# EAGLE schematic power (EAGLE 9.3.0)

## Sheet 1 of 2
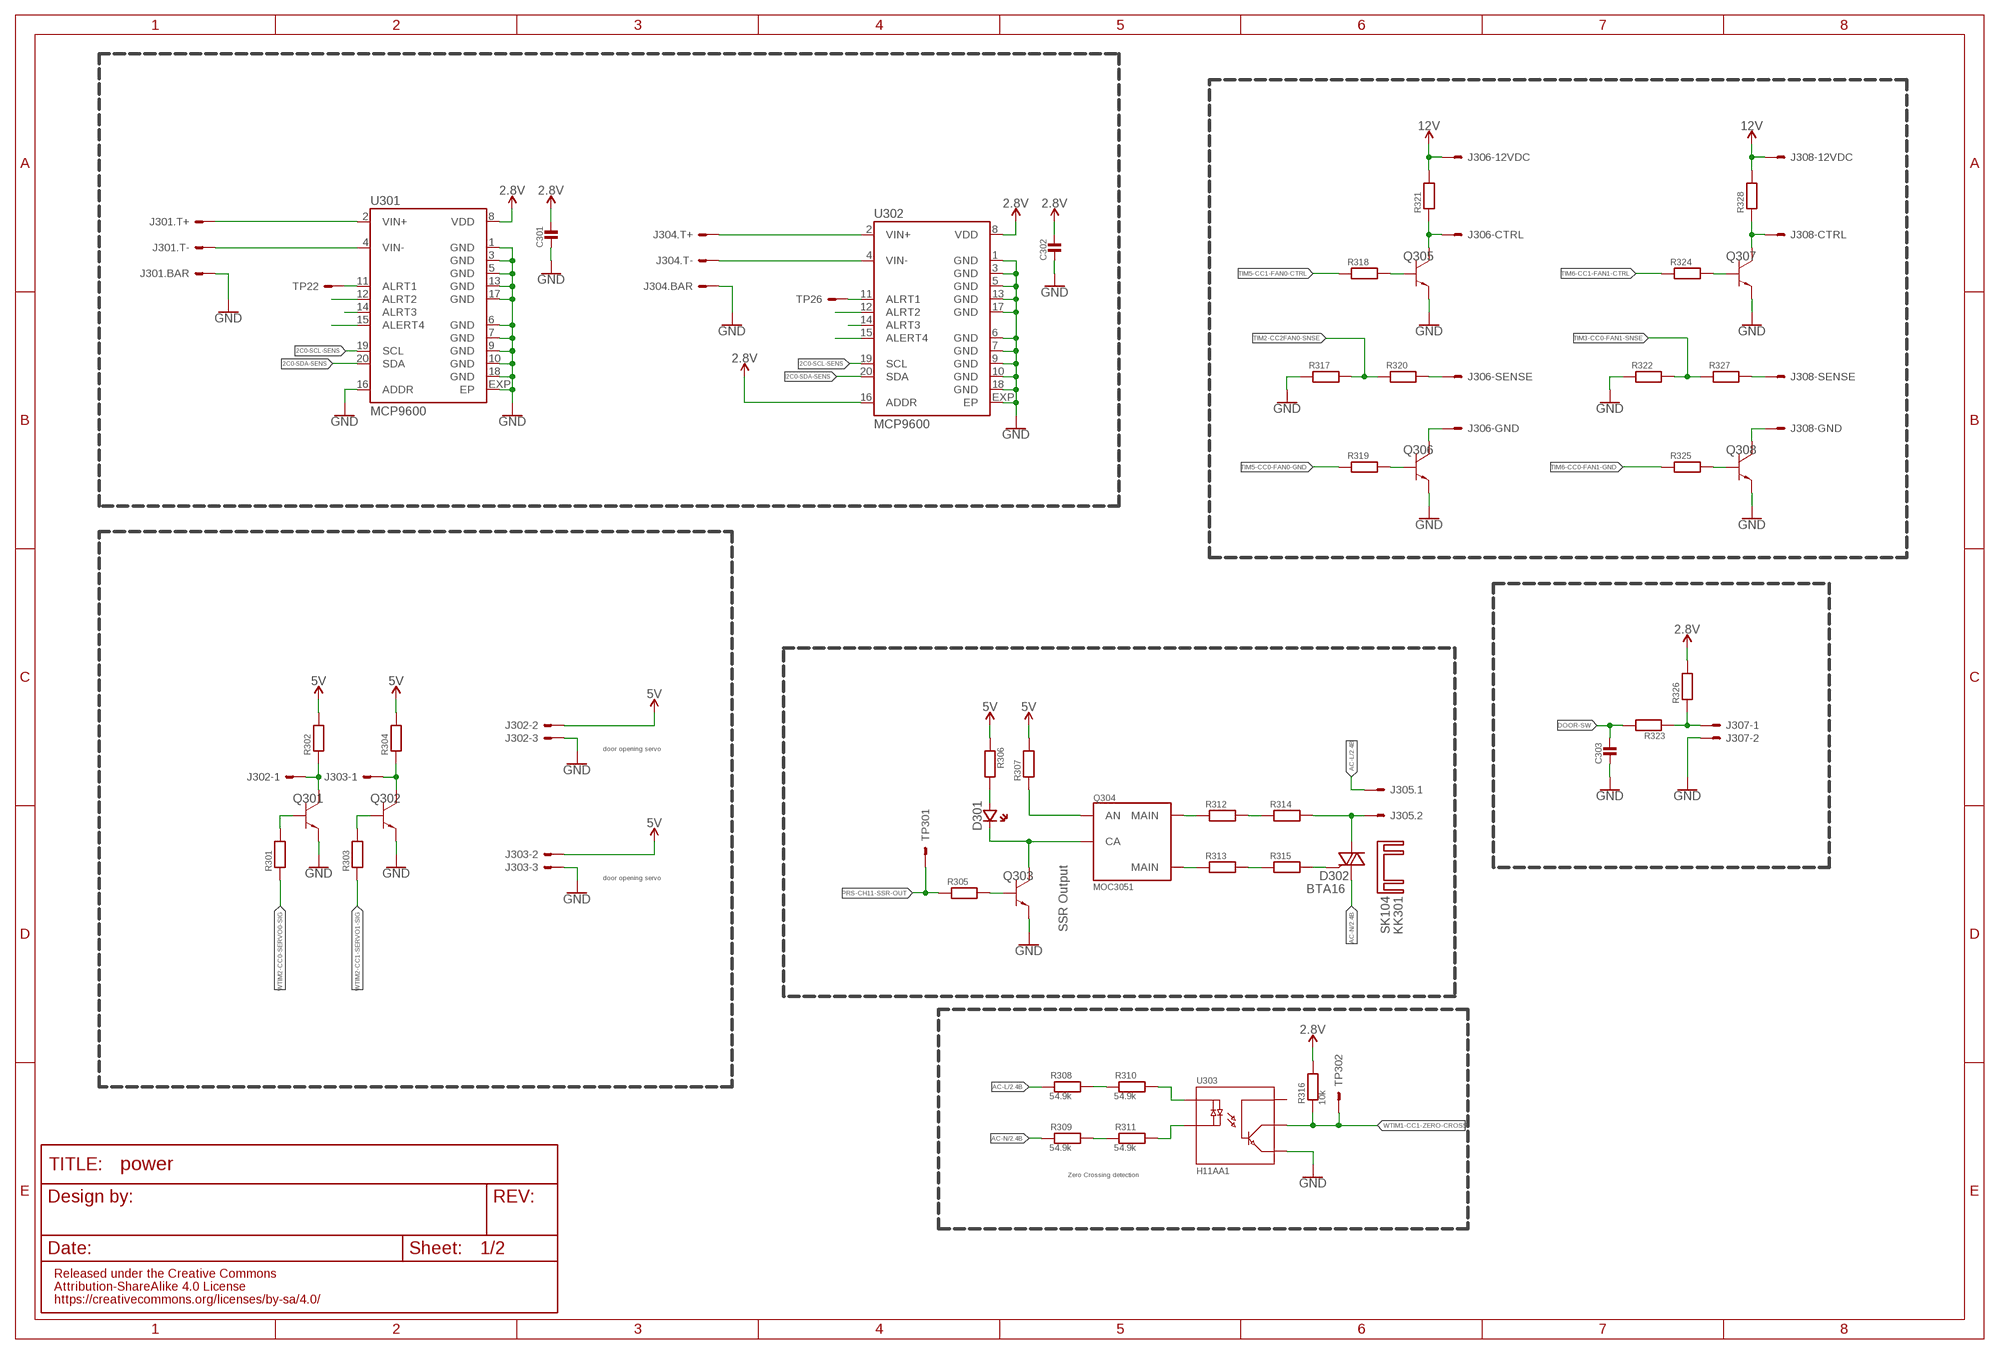
[diagram p0: schematic, sheet 1]

### Parts
C301  MLCC0603  [0603_WAVE]
C302  MLCC0603  [0603_WAVE]
C303  MLCC0603  [0603_WAVE]
D301  LED0603  [CHIPLED_0603]
D302  BTA16  [TO220DS]
J301  PCC-SMP  [PCC-SMP]
J302  3X1_2.54  [3X1_2.54]
J303  3X1_2.54  [3X1_2.54]
J304  PCC-SMP  [PCC-SMP]
J305  2EDG-2P  [2EDG-2P]
J306  4P-PC-FAN  [KF2510-3+1P]
J307  2X1_2.54  [2X1_2.54]
J308  4P-PC-FAN  [KF2510-3+1P]
KK301  SK104  [SK104]
Q301  BC817-40  [SOT-23-3]
Q302  BC817-40  [SOT-23-3]
Q303  BC817-40  [SOT-23-3]
Q304  MOC3051  [DIP-6-SMD]
Q305  BC817-40  [SOT-23-3]
Q306  BC817-40  [SOT-23-3]
Q307  BC817-40  [SOT-23-3]
Q308  BC817-40  [SOT-23-3]
R301  RESISTOR0603  [0603_WAVE]
R302  RESISTOR0603  [0603_WAVE]
R303  RESISTOR0603  [0603_WAVE]
R304  RESISTOR0603  [0603_WAVE]
R305  RESISTOR0603  [0603_WAVE]
R306  RESISTOR0603  [0603_WAVE]
R307  RESISTOR0603  [0603_WAVE]
R308  54.9k  RESISTOR_1206  [_1206]
R309  54.9k  RESISTOR_1206  [_1206]
R310  54.9k  RESISTOR_1206  [_1206]
R311  54.9k  RESISTOR_1206  [_1206]
R312  RESISTOR_1206  [_1206]
R313  RESISTOR_1206  [_1206]
R314  RESISTOR_1206  [_1206]
R315  RESISTOR_1206  [_1206]
R316  10k  RESISTOR0603  [0603_WAVE]
R317  RESISTOR0603  [0603_WAVE]
R318  RESISTOR0603  [0603_WAVE]
R319  RESISTOR0603  [0603_WAVE]
R320  RESISTOR0603  [0603_WAVE]
R321  RESISTOR0603  [0603_WAVE]
R322  RESISTOR0603  [0603_WAVE]
R323  RESISTOR0603  [0603_WAVE]
R324  RESISTOR0603  [0603_WAVE]
R325  RESISTOR0603  [0603_WAVE]
R326  RESISTOR0603  [0603_WAVE]
R327  RESISTOR0603  [0603_WAVE]
R328  RESISTOR0603  [0603_WAVE]
TP22  TEST_POINT  [TEST_POINT]
TP26  TEST_POINT  [TEST_POINT]
TP301  TEST_POINT  [TEST_POINT]
TP302  TEST_POINT  [TEST_POINT]
U301  MCP9600  [TQFN20-5X5]
U302  MCP9600  [TQFN20-5X5]
U303  H11AA1  [DIP-6-SMD]

### Nets
2.8V: C301.P$1 C302.P$1 R316.P$2 R326.P$2 U301.8(VDD) U302.8(VDD) U302.16(ADDR)
5V: J302.P$2 J303.P$2 R302.P$2 R304.P$2 R306.P$1 R307.P$2 ; also sheet 2
12V: J306.2 J308.2 R321.P$2 R328.P$2 ; also sheet 2
AC-L: J305.P$1 R308.1 ; also sheet 2
AC-N: D302.A1 R309.1 ; also sheet 2
DOOR-SW: C303.P$1 R323.P$2
GND: C301.P$2 C302.P$2 C303.P$2 J301.3-BAR J301.4-BAR J302.P$3 J303.P$3 J304.3-BAR J304.4-BAR J307.2 Q301.P$2(EM2) Q302.P$2(EM2) Q303.P$2(EM2) Q305.P$2(EM2) Q306.P$2(EM2) Q307.P$2(EM2) Q308.P$2(EM2) R317.P$1 R322.P$1 U301.1(GND) U301.3(GND) U301.5(GND) U301.6(GND) U301.7(GND) U301.9(GND) U301.10(GND) U301.13(GND) U301.16(ADDR) U301.17(GND) U301.18(GND) U301.EXP(EP) U302.1(GND) U302.3(GND) U302.5(GND) U302.6(GND) U302.7(GND) U302.9(GND) U302.10(GND) U302.13(GND) U302.17(GND) U302.18(GND) U302.EXP(EP) U303.P$4(E) ; also sheet 2
I2C0-SCL-SENS: U301.19(SCL) U302.19(SCL)
I2C0-SDA-SENS: U301.20(SDA) U302.20(SDA)
N$1: J307.1 R323.P$1 R326.P$1
N$2: D302.A2 J305.P$2 R314.2
N$5: Q303.P$1(BA1) R305.P$2
N$7: D301.C(CA) Q303.P$3(C03) Q304.P$2(CA)
N$20: R308.2 R310.1
N$21: R310.2 U303.P$1(AC)
N$29: R311.2 U303.P$2(CA)
N$30: R309.2 R311.1
N$34: Q304.P$1(AN) R307.P$1
N$37: Q304.P$4(MAIN) R312.1
N$38: Q304.P$6(MAIN) R313.1
N$39: R312.2 R314.1
N$40: R313.2 R315.1
N$42: D302.G R315.2
N$49: Q301.P$1(BA1) R301.P$2
N$50: J302.P$1 Q301.P$3(C03) R302.P$1
N$51: D301.A(AN) R306.P$2
N$52: J303.P$1 Q302.P$3(C03) R304.P$1
N$53: Q302.P$1(BA1) R303.P$2
N$56: Q306.P$1(BA1) R319.P$2
N$57: J306.1 Q306.P$3(C03)
N$58: Q305.P$1(BA1) R318.P$2
N$59: J306.4 Q305.P$3(C03) R321.P$1
N$60: Q308.P$1(BA1) R325.P$2
N$61: Q307.P$1(BA1) R324.P$2
N$62: J308.4 Q307.P$3(C03) R328.P$1
N$63: J308.1 Q308.P$3(C03)
N$64: J306.3 R320.P$2
N$65: J308.3 R327.P$2
PRS-CH11-SSR-OUT: R305.P$1 TP301.1(S)
TC_VIN0+: J301.1-T+ U301.2(VIN+)
TC_VIN0-: J301.2-T- U301.4(VIN-)
TC_VIN1+: J304.1-T+ U302.2(VIN+)
TC_VIN1-: J304.2-T- U302.4(VIN-)
TIM2-CC2FAN0-SNSE: R317.P$2 R320.P$1
TIM3-CC0-FAN1-SNSE: R322.P$2 R327.P$1
TIM5-CC0-FAN0-GND: R319.P$1
TIM5-CC1-FAN0-CTRL: R318.P$1
TIM6-CC0-FAN1-GND: R325.P$1
TIM6-CC1-FAN1-CTRL: R324.P$1
U4-ALRT1: TP22.1(S) U301.11(ALRT1)
U4-ALRT2: U301.12(ALRT2)
U4-ALRT3: U301.14(ALRT3)
U4-ALRT4: U301.15(ALERT4)
U7-ALRT1: TP26.1(S) U302.11(ALRT1)
U7-ALRT2: U302.12(ALRT2)
U7-ALRT3: U302.14(ALRT3)
U7-ALRT4: U302.15(ALERT4)
WTIM1-CC1-ZERO-CROSS: R316.P$1 TP302.1(S) U303.P$5(C)
WTIM2-CC0-SERVO0-SIG: R301.P$1
WTIM2-CC1-SERVO1-SIG: R303.P$1
Unconnected: U303.P$6(B)

### Notes on the sheet
- door opening servo
- door opening servo
- SSR Output
- Zero Crossing detection

## Sheet 2 of 2
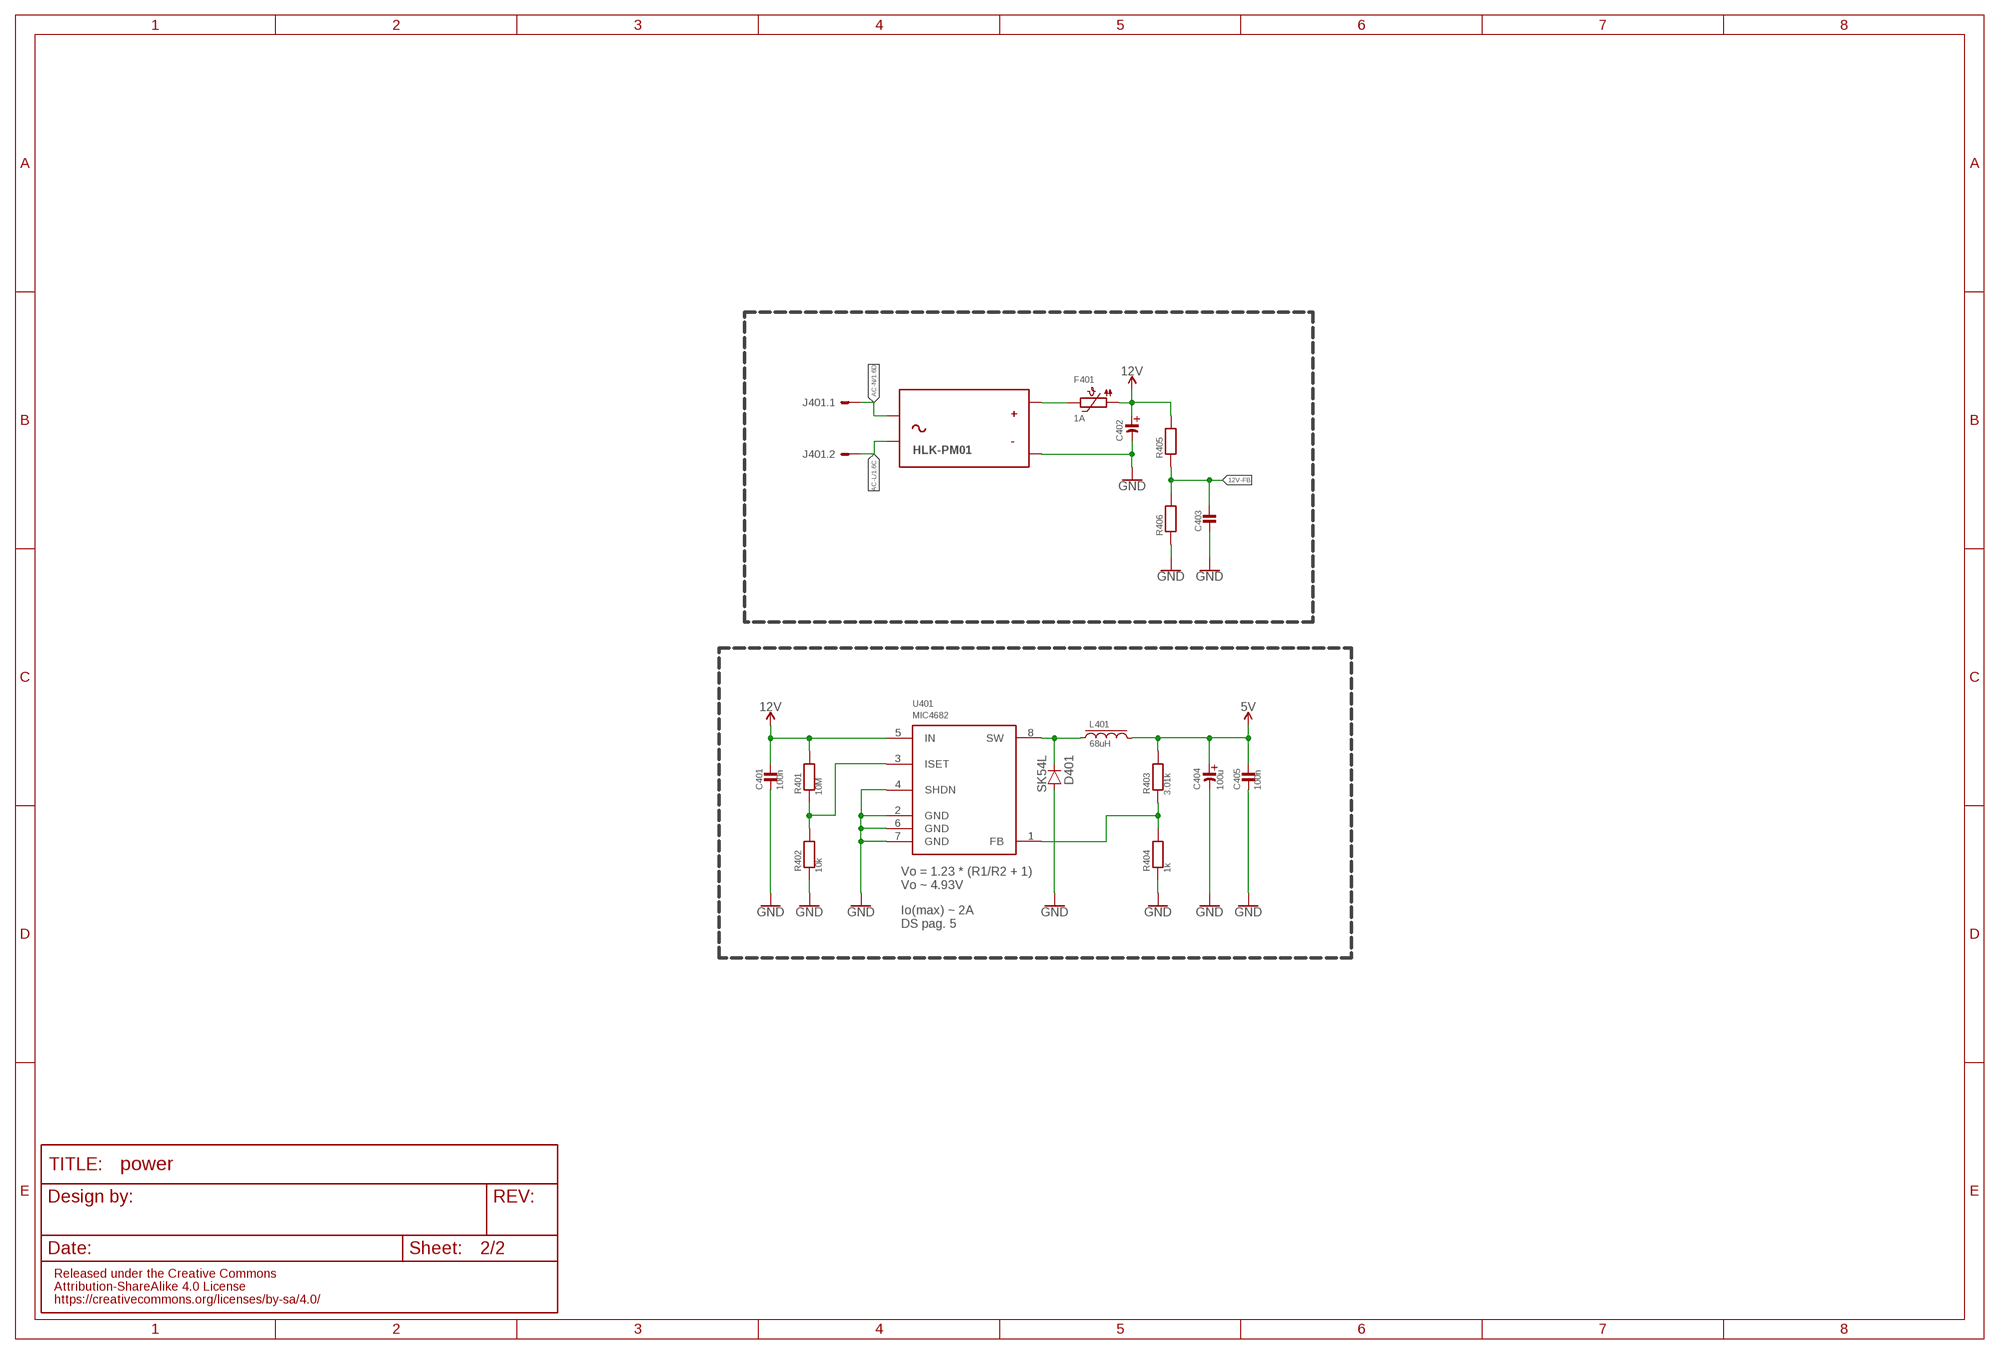
[diagram p1: schematic, sheet 2]

### Parts
ACDC401  HLK-PM01  [HLK-PM01]
C401  100n  MLCC0603  [0603_WAVE]
C402  CAPACITOR_ELD  [PANASONIC_D]
C403  MLCC0603  [0603_WAVE]
C404  100u  CAPACITOR_ELD  [PANASONIC_D]
C405  100n  MLCC0603  [0603_WAVE]
D401  SK54L  [DO214AA]
F401  1A  PTC1812  [PTC1812]
J401  2EDG-2P  [2EDG-2P]
L401  68uH  INDUCTOR1207  [1207]
R401  10M  RESISTOR0603  [0603_WAVE]
R402  10k  RESISTOR0603  [0603_WAVE]
R403  3.01k  RESISTOR0603  [0603_WAVE]
R404  1k  RESISTOR0603  [0603_WAVE]
R405  RESISTOR0603  [0603_WAVE]
R406  RESISTOR0603  [0603_WAVE]
U401  MIC4682  [SOIC8]

### Nets
5V: C404.+(AN) C405.P$1 L401.2 R403.P$2 ; also sheet 1
5V-FB: R403.P$1 R404.P$2 U401.1(FB)
12V: C401.P$1 C402.+(AN) F401.P$1 R401.P$2 R405.P$2 U401.5(IN) ; also sheet 1
12V-FB: C403.P$1 R405.P$1 R406.P$2
AC-L: ACDC401.AC2 J401.P$2 ; also sheet 1
AC-N: ACDC401.AC1 J401.P$1 ; also sheet 1
GND: ACDC401.-VO C401.P$2 C402.-(CA) C403.P$2 C404.-(CA) C405.P$2 D401.A R402.P$1 R404.P$1 R406.P$1 U401.2(GND) U401.4(SHDN) U401.6(GND) U401.7(GND) ; also sheet 1
N$31: ACDC401.+VO F401.P$2
N$45: D401.C L401.1 U401.8(SW)
N$47: R401.P$1 R402.P$2 U401.3(ISET)

### Notes on the sheet
- Vo = 1.23 * (R1/R2 + 1)
  Vo ~ 4.93V
- Io(max) ~ 2A
  DS pag. 5

## Library data of the parts
ACDC401 = Power > AC\DC Converters:HLK-PM01
C301-C303 C401 C403 C405 = Passive Components > Capacitors > Multilayer Ceramic Capacitors MLCC:MLCC: KEMET’s X7R dielectric features a 125°C maximum operating temperature and is considered temperature stable. The Electronics Components, Assemblies and Materials Association (EIA) characterizes X7R dielectric as a Class II material. Components of this classification are fixed, ceramic dielectric capacitors suited for bypass and decoupling applications or for frequency discriminating circuits where Q and stability of capacitance characteristics are not critical. X7R exhibits a predictable change in capacitance with respect to time and voltage, boasting a minimal change in capacitance with reference to ambient temperature. Capacitance change is limited to ±15% from −55°C to +125°C.
C402 C404 = Passive Components > Capacitors > Aluminium Electrolytic Capacitors:CAPACITOR_EL
D301 = Opto-electronics > LED Emitters:LED: LED 0603 - 0603 Surface Mount Package 2mA: Green LED - Low Power (3.9mcd, 2ma, 1.7Vf) - Digikey: 475-2709-2-ND Orange LED - Low Power (9.8mcd, 2ma, 1.8Vf) - Digikey: 475-1194-2-ND Red LED - Low Power (5mcd, 2ma, 1.8Vf) - Digikey: 475-1195-2-ND Yellow LED - Low Power (7mcd, 2ma, 1.8Vf) - Digikey: 475-1196-2-ND 5mA: Blue LED - Low Power (17mcd, 5ma, 2.9Vf) - Digikey: LNJ937W8CRACT-ND 0805 - 0805 Surface Mount Package 2mA: Red LED (8.8mcd, 2mA, 1.8Vf, Clear) - Low Power [Digikey: 475-2510-1-ND] Green LED (5mcd, 2mA, 1.8Vf, Clear) - Low Power [Digikey: 475-2730-1-ND] Yellow LED (11.3mcd, 2mA, 1.8Vf, Clear) - Low Power [Digikey: 475-2555-1-ND] 20mA: Red LED (104mcd, 20mA, Diffused) - LS R976 [Digikey: 475-1278-6-ND] Red LED (12mcd, 20mA, 2.0Vf, Clear) - APT2012EC [Digikey: 754-1128-1-ND] Green LED (15mcd, 20mA, 2.2Vf, Clear) - APT2012GC [Digikey: 754-1131-1-ND] Orange LED (160mcd, 20mA, 2.1Vf, Clear) - APT2012SECK [Digikey: 754-1130-1-ND] 1206 - 1206 Surface Mount Package Green LED (26mcd, 20mA, Diffused) - LG N971 [Digikey: 475-1407-6-ND] Red LED (15mcd, 20mA, Diffused) - LH N974 [Digikey: 475-1416-6-ND] Cree - Cree High-Power Surface Mount LEDs XPEBWT-L1-0000-00D50 - White 111lm 350mA 2.9Vf 6200K 110° XTEAWT-00-0000-00000LEE3 - White 114lm 350mA 2.85Vf 5000K 115° Everlight - Everlight 45-21 Series Surface Mount LEDs 45-21/QK2C-B2832AC2CB2/2T - Warm White 2000mcd 20mA 3.25Vf 3050K 120° 45-21/LK2C-B38452C4CB2/2T - Nuetral White 2000mcd 20mA 3.25Vf 4150K 120° 45-21/LK2C-B50634C6CB2/2T - Cold White 2200mcd 20mA 3.25Vf 5650K 120° PLCC2 Reverse Mount LS T77K-J1L2-1-0-2-R18-Z - Red 11.25mcd 2mA 1.8Vf 630nm 120° LO T77K-L1M2-24-Z - Orange 19.6mcd 2mA 1.8Vf 606nm 120° LY T77K-K2M1-26-Z - Yellow 15.7mcd 2mA 1.8Vf 587nm 120°
D302 = Semiconductors > Discrete Semiconductors > Thyristors > Triacs:BTA16
D401 = Semiconductors > Discrete Semiconductors > Diodes & Rectifiers > Schottky Diodes & Rectifiers:SK54L
F401 = Circuit Protection > Resettable Fuses - PPTC:PTC
J301 J304 = Connectors > Other:PCC-SMP
J302 J303 = Connectors > Header:3X1_2.54
J305 J401 = Connectors > Other:2EDG-2P
J306 J308 = Thermal Management > Fans & Blowers:4P-PC-FAN
J307 = Connectors > Header:2X1_2.54
KK301 = Thermal Management > Heatsinks:SK104: HEATSINK manufacturer Fischer/distributor Buerklin
L401 = Passive Components > Inductors, Chokes & Coils:INDUCTOR
Q301-Q303 Q305-Q308 = Semiconductors > Discrete Semiconductors > Transistors > Bipolar Transistors - BJT:BC817-40
Q304 = Opto-electronics > Optocouplers\Photocouplers:MOC3051: The MOC3051-M and MOC3052-M consist of a AlGaAs infrared emitting diode optically coupled to a non-zero-crossing silicon bilateral AC switch (triac). These devices isolate low voltage logic from 115 and 240 Vac lines to provide random phase control of high current triacs or thyristors. These devices feature greatly enhanced static dv/dt capability to ensure stable switching performance of inductive loads.
R301-R328 R401-R406 = Passive Components > Resistors > Chip Resistors:RESISTOR: Resistors For new designs, use the packages preceded by an '_' character since they are more reliable: The following footprints should be used on most boards: _0402 - Standard footprint for regular board layouts _0603 - Standard footprint for regular board layouts _0805 - Standard footprint for regular board layouts _1206 - Standard footprint for regular board layouts For extremely tight-pitch boards where space is at a premium, the following 'micro-pitch' footprints can be used (smaller pads, no silkscreen outline, etc.): _0402MP - Micro-pitch footprint for very dense/compact boards _0603MP - Micro-pitch footprint for very dense/compact boards _0805MP - Micro-pitch footprint for very dense/compact boards _1206MP - Micro-pitch footprint for very dense/compact boards
TP22 TP26 TP301 TP302 = Utility > Board:TEST_POINT
U301 U302 = Sensors > Temperature Sensors:MCP9600
U303 = Opto-electronics > Optocouplers\Photocouplers:H11AA1
U401 = Power > Switching Controllers:MIC4682